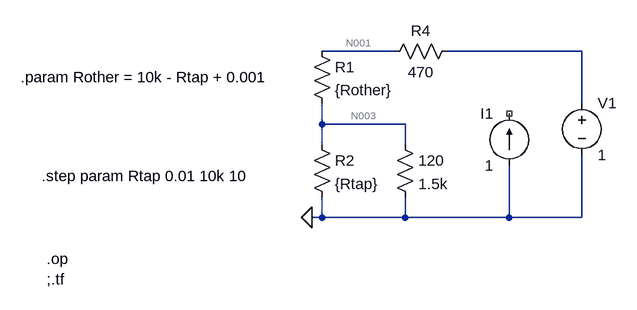
[diagram p0: schematic lin_per_loudness_poti_sim.asc]
lin_per_loudness_poti_sim.asc, the LTspice schematic file:
Version 4
SHEET 1 880 680
WIRE 192 64 80 64
WIRE 480 64 272 64
WIRE 480 144 480 64
WIRE 80 176 80 144
WIRE 208 176 80 176
WIRE 80 208 80 176
WIRE 208 208 208 176
WIRE 80 320 80 288
WIRE 80 320 64 320
WIRE 208 320 208 288
WIRE 208 320 80 320
WIRE 368 320 368 240
WIRE 368 320 208 320
WIRE 480 320 480 224
WIRE 480 320 368 320
FLAG 64 320 0
SYMBOL res 64 48 R0
SYMATTR InstName R1
SYMATTR Value {Rother}
SYMBOL res 64 192 R0
SYMATTR InstName R2
SYMATTR Value {Rtap}
SYMBOL res 192 192 R0
SYMATTR InstName 120
SYMATTR Value 1.5k
SYMBOL current 368 240 R180
WINDOW 0 24 80 Left 2
WINDOW 3 24 0 Left 2
WINDOW 123 0 0 Left 0
WINDOW 39 0 0 Left 0
SYMATTR InstName I1
SYMATTR Value 1
SYMBOL res 288 48 R90
WINDOW 0 0 56 VBottom 2
WINDOW 3 32 56 VTop 2
SYMATTR InstName R4
SYMATTR Value 470
SYMBOL voltage 480 128 R0
WINDOW 123 0 0 Left 0
WINDOW 39 0 0 Left 0
SYMATTR InstName V1
SYMATTR Value 1
TEXT -384 104 Left 2 !.param Rother = 10k - Rtap + 0.001
TEXT -352 256 Left 2 !.step param Rtap 0.01 10k 10
TEXT -344 384 Left 2 !.op\n;.tf

The netlist it stands for:
* lin_per_loudness_poti_sim.asc
R1 N001 N003 {Rother}
R2 N003 0 {Rtap}
R§120 N003 0 1.5k
I1 0 NC_01 1
R4 N002 N001 470
V1 N002 0 1
.param Rother = 10k - Rtap + 0.001
.step param Rtap 0.01 10k 10
.op
;.tf
.backanno
.end

* Results of the author's LTspice run, read from the files saved beside the schematic
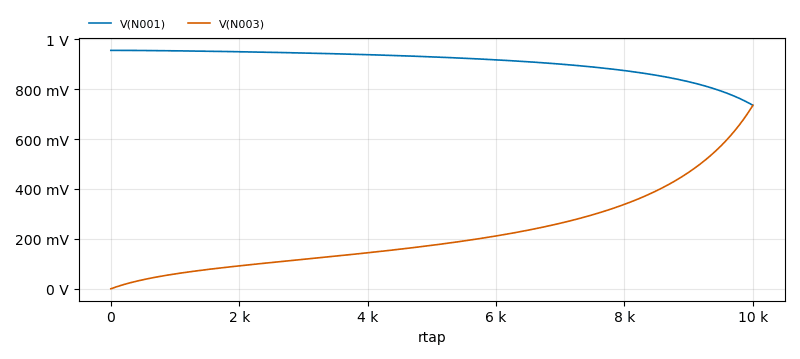
[diagram p1: Operating Point of lin_per_loudness_poti_sim.asc, plotted from the saved traces]
* Operating Point, 1 run:
*   V(N001): 955.1 mV at rtap=10 m, 735.1 mV at rtap=10 k, min 735.1 mV, max 955.1 mV
*   V(N003): 955.1 nV at rtap=10 m, 735.1 mV at rtap=10 k, min 955.1 nV, max 735.1 mV